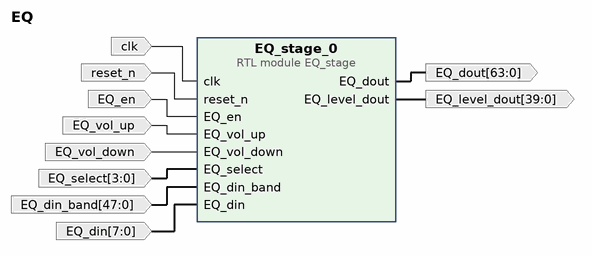
[diagram p0: block diagram of the top level]
# Vivado block design EQ, xc7s50csga324-1, Vivado 2018.3
create_bd_design EQ

create_bd_port -dir I -type clk clk
set_property -dict {CONFIG.FREQ_HZ 108000000} [get_bd_ports clk]
create_bd_port -dir I -type rst reset_n
create_bd_port -dir I EQ_en
create_bd_port -dir O -from 63 -to 0 EQ_dout
create_bd_port -dir I EQ_vol_up
create_bd_port -dir I EQ_vol_down
create_bd_port -dir O -from 39 -to 0 EQ_level_dout
create_bd_port -dir I -from 3 -to 0 EQ_select
create_bd_port -dir I -from 47 -to 0 EQ_din_band
create_bd_port -dir I -from 7 -to 0 EQ_din

create_bd_cell -type module -reference EQ_stage EQ_stage_0

# ---- connections ----

connect_bd_net [get_bd_ports clk] [get_bd_pins EQ_stage_0/clk]
connect_bd_net [get_bd_ports reset_n] [get_bd_pins EQ_stage_0/reset_n]
connect_bd_net [get_bd_ports EQ_en] [get_bd_pins EQ_stage_0/EQ_en]
connect_bd_net [get_bd_pins EQ_stage_0/EQ_dout] [get_bd_ports EQ_dout]
connect_bd_net [get_bd_ports EQ_vol_up] [get_bd_pins EQ_stage_0/EQ_vol_up]
connect_bd_net [get_bd_ports EQ_vol_down] [get_bd_pins EQ_stage_0/EQ_vol_down]
connect_bd_net [get_bd_pins EQ_stage_0/EQ_level_dout] [get_bd_ports EQ_level_dout]
connect_bd_net [get_bd_ports EQ_select] [get_bd_pins EQ_stage_0/EQ_select]
connect_bd_net [get_bd_ports EQ_din_band] [get_bd_pins EQ_stage_0/EQ_din_band]
connect_bd_net [get_bd_ports EQ_din] [get_bd_pins EQ_stage_0/EQ_din]

validate_bd_design
save_bd_design
